# EAGLE design fpv (EAGLE 6.5.0)
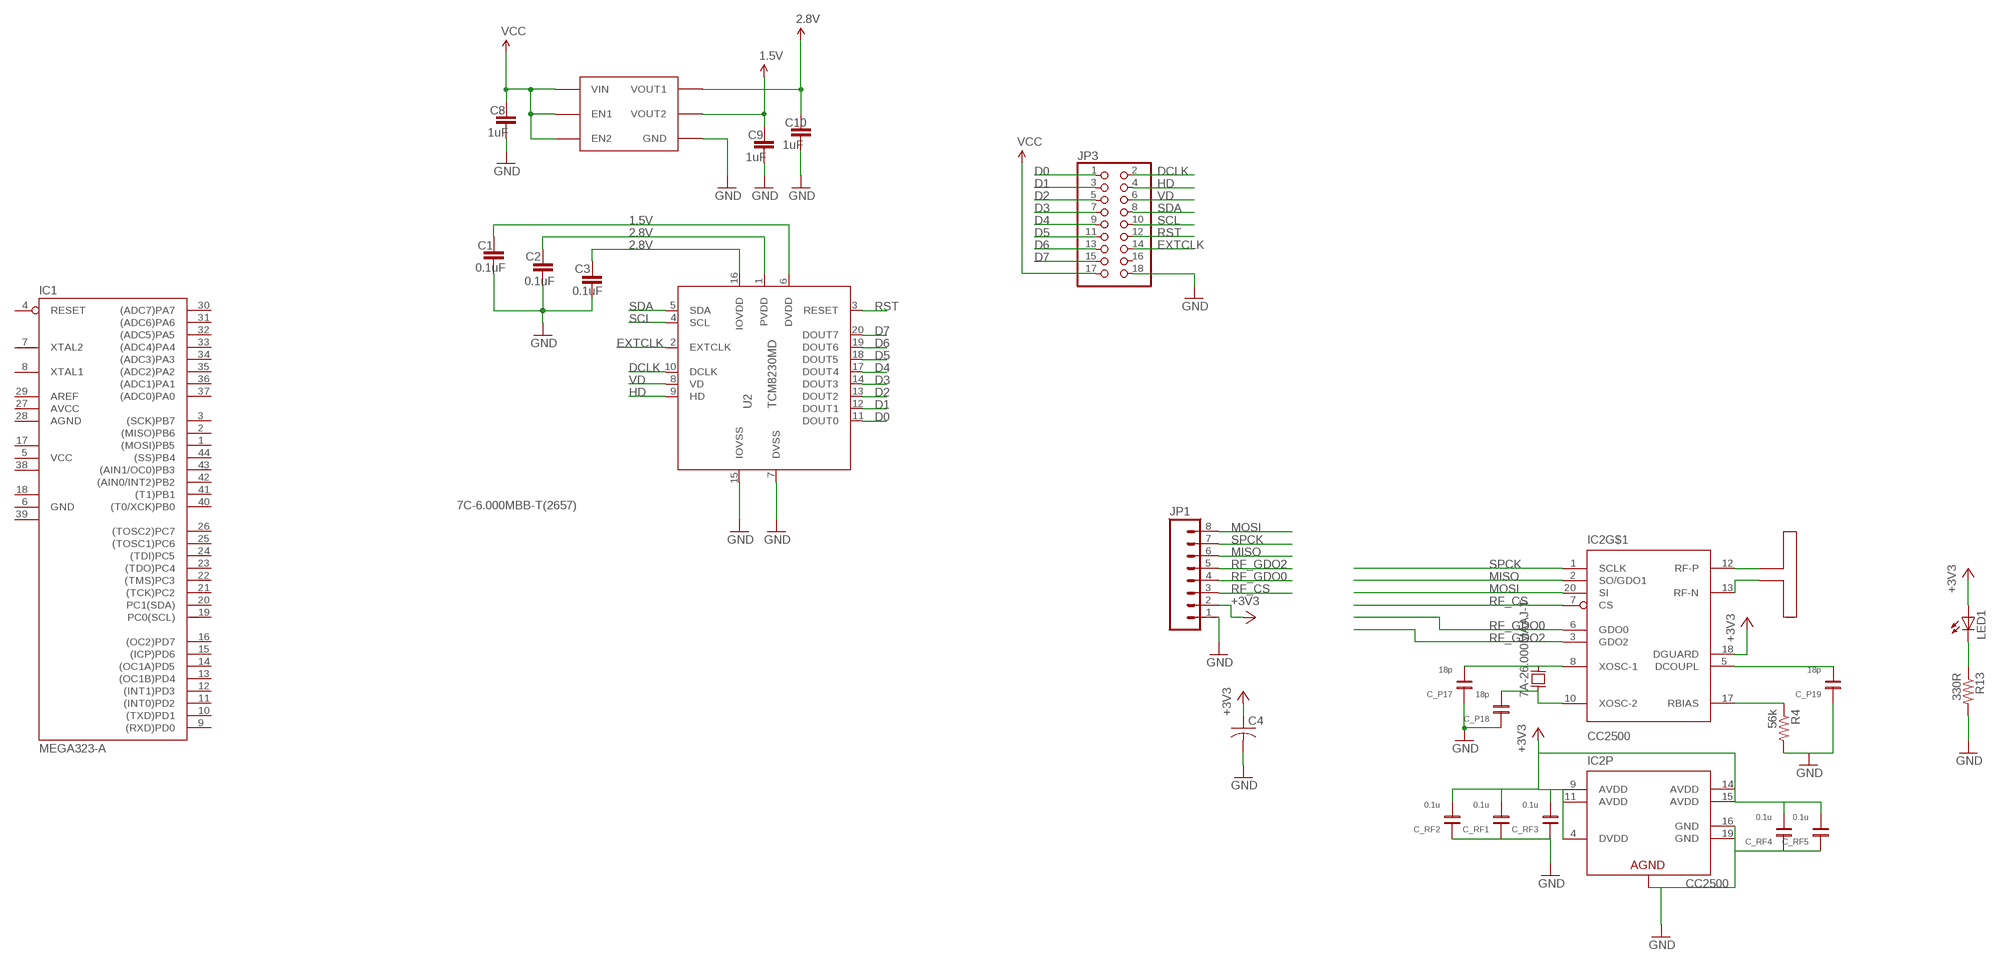
[diagram p0: schematic, sheet 1]

## Parts
C1  0.1uF  CAP0402-CAP  [0402-CAP]
C2  0.1uF  CAP0402-CAP  [0402-CAP]
C3  0.1uF  CAP0402-CAP  [0402-CAP]
C4  C-USC1206  [C1206]
C8  1uF  CAP0402-CAP  [0402-CAP]
C9  1uF  CAP0402-CAP  [0402-CAP]
C10  1uF  CAP0402-CAP  [0402-CAP]
C_P17  18p  CAPACITOR0603-CAP  [0603-CAP]
C_P18  18p  CAPACITOR0603-CAP  [0603-CAP]
C_P19  18p  CAPACITOR0603-CAP  [0603-CAP]
C_RF1  0.1u  CAPACITOR0603-CAP  [0603-CAP]
C_RF2  0.1u  CAPACITOR0603-CAP  [0603-CAP]
C_RF3  0.1u  CAPACITOR0603-CAP  [0603-CAP]
C_RF4  0.1u  CAPACITOR0603-CAP  [0603-CAP]
C_RF5  0.1u  CAPACITOR0603-CAP  [0603-CAP]
IC1  MEGA323-A  [TQFP44]
IC2  CC2500  [QLP-20]
JP1  M081X08  [1X08]
JP3  PINHD-2X9  [2X09]
LED1  LED1206  [LED-1206]
R4  56k  RESISTOR0402-RES  [0402-RES]
R13  330R  RESISTOR0402-RES  [0402-RES]
U1  MIC5320  [SOT23-6]
U2  TCM8230MD  [TCM8230MD]
U$22  ANTENNA_DIPOLE  [CC2500_FOLDED_DIPOLE_ANTENNA]
U$23  7A-26.000MAAJ-T  XTAL_2_PIN5MMX3.2MM  [5X3.2MM_SMD_XTAL]

## Nets
1.5V: C1.1 C9.1 U1.5(VOUT2) U2.6(DVDD)
2.8V: C2.1 C3.1 C10.1 U1.4(VOUT1) U2.1(PVDD) U2.16(IOVDD)
+3V3 [Power]: C4.1 C_RF1.2 C_RF2.2 C_RF3.2 C_RF4.2 C_RF5.2 IC2.4(P:DVDD) IC2.9(P:AVDD) IC2.11(P:AVDD) IC2.14(P:AVDD) IC2.15(P:AVDD) IC2.18(DGUARD) JP1.2 LED1.A
D0: JP3.1 U2.11(DOUT0)
D1: JP3.3 U2.12(DOUT1)
D2: JP3.5 U2.13(DOUT2)
D3: JP3.7 U2.14(DOUT3)
D4: JP3.9 U2.17(DOUT4)
D5: JP3.11 U2.18(DOUT5)
D6: JP3.13 U2.19(DOUT6)
D7: JP3.15 U2.20(DOUT7)
DCLK: JP3.2 U2.10(DCLK)
DCOUPL: C_P19.2 IC2.5(DCOUPL)
EXTCLK: JP3.14 U2.2(EXTCLK)
GND: C1.2 C2.2 C3.2 C4.2 C8.2 C9.2 C10.2 C_P17.1 C_P18.1 C_P19.1 C_RF1.1 C_RF2.1 C_RF3.1 C_RF4.1 C_RF5.1 IC2.16(P:GND) IC2.19(P:GND) IC2.PAD(P:AGND) IC2.THERMAL1(P:AGND) IC2.THERMAL2(P:AGND) IC2.THERMAL3(P:AGND) IC2.THERMAL4(P:AGND) IC2.THERMAL5(P:AGND) JP1.1 JP3.18 R4.2 R13.2 U1.2(GND) U2.7(DVSS) U2.15(IOVSS)
HD: JP3.4 U2.9(HD)
MISO: IC2.2(SO/GDO1) JP1.6
MOSI: IC2.20(SI) JP1.8
N$6: LED1.C R13.1
N$8: IC2.12(RF-P) U$22.P$1
N$13: IC2.13(RF-N) U$22.P$2
N$15: C_P17.2 IC2.8(XOSC-1) U$23.X2
N$20: C_P18.2 IC2.10(XOSC-2) U$23.X1
N$23: IC2.17(RBIAS) R4.1
RF_CS: IC2.7(CS) JP1.3
RF_GDO0: IC2.6(GDO0) JP1.4
RF_GDO2: IC2.3(GDO2) JP1.5
RST: JP3.12 U2.3(RESET)
SCL: JP3.10 U2.4(SCL)
SDA: JP3.8 U2.5(SDA)
SPCK: IC2.1(SCLK) JP1.7
VCC: C8.1 JP3.17 U1.1(EN2) U1.3(VIN) U1.6(EN1)
VD: JP3.6 U2.8(VD)
Unconnected: IC1.1((MOSI)PB5) IC1.2((MISO)PB6) IC1.3((SCK)PB7) IC1.4(RESET) IC1.7(XTAL2) IC1.8(XTAL1) IC1.9((RXD)PD0) IC1.10((TXD)PD1) IC1.11((INT0)PD2) IC1.12((INT1)PD3) IC1.13((OC1B)PD4) IC1.14((OC1A)PD5) IC1.15((ICP)PD6) IC1.16((OC2)PD7) IC1.19(PC0(SCL)) IC1.20(PC1(SDA)) IC1.21((TCK)PC2) IC1.22((TMS)PC3) IC1.23((TDO)PC4) IC1.24((TDI)PC5) IC1.25((TOSC1)PC6) IC1.26((TOSC2)PC7) IC1.29(AREF) IC1.30((ADC7)PA7) IC1.31((ADC6)PA6) IC1.32((ADC5)PA5) IC1.33((ADC4)PA4) IC1.34((ADC3)PA3) IC1.35((ADC2)PA2) IC1.36((ADC1)PA1) IC1.37((ADC0)PA0) IC1.40((T0/XCK)PB0) IC1.41((T1)PB1) IC1.42((AIN0/INT2)PB2) IC1.43((AIN1/OC0)PB3) IC1.44((SS)PB4) JP3.16

## Notes on the sheet
- 7C-6.000MBB-T(2657)

## Power pins joined to a net without a drawn wire
AGND: IC1.28(AGND)
AVCC: IC1.27(AVCC)
GND: IC1.6(GND)
GND1: IC1.18(GND1)
GND2: IC1.39(GND2)
VCC: IC1.5(VCC)
VCC1: IC1.17(VCC1)
VCC2: IC1.38(VCC2)

## Library data of the parts
C1-C3 C8-C10 = sfe:CAP: Capacitor Standard 0603 ceramic capacitor, and 0.1" leaded capacitor.
C4 = rcl:C-US: CAPACITOR, American symbol
C_P17-C_P19 C_RF1-C_RF5 = taylor:CAPACITOR
IC1 = atmel:MEGA323: MICROCONTROLLER 32 Kbytes FLASH 2 Kbytes SRAM 1 Kbytes EEPROM USART 8-channel 10 bit ADC Source: avr.lbr; OC_FARNELL: unknown; OC_NEWARK: unknown
IC2 = chipcon-ti:CC2500: Single Chip Low Cost Low Power RF Transceiver frequency band at 2400MHz-2483.5MHz.
JP1 = SparkFun:M08: Header 8 Standard 8-pin 0.1" header. Use with straight break away headers (SKU : PRT-00116), right angle break away headers (PRT-00553), swiss pins (PRT-00743), machine pins (PRT-00117), and female headers (PRT-00115).
JP3 = pinhead:PINHD-2X9: PIN HEADER
LED1 = SparkFun:LED: LEDs Standard schematic elements and footprints for 5mm, 3mm, 1206, and 0603 sized LEDs. 5mm - Spark Fun Electronics SKU : COM-00529 (and others)
R4 R13 = SparkFun:RESISTOR: Resistor Basic schematic elements and footprints for 0603, 1206, and PTH resistors.
U1 = heka:MIC5320
U2 = tcm82x0md:TCM8230MD: TCM8240MD 0.3 Mega pixel sensor chip mfg TOSHIBA symbol/package by Kyrre Aalerud Note: Chip has pads for socket mounting on underside. Do not route anything under the chip unless you insulate it.
U$22 = taylor:ANTENNA_DIPOLE
U$23 = taylor:XTAL_2_PIN: 5mm x 3.2mm smd crystal 16MHz and other 8pF load caps 644-1037-1-ND NX5032GA-16.000000MHZ 6mmx3.5mm 18.432MHz and 20MHz crystals 20pF load XC826CT-ND XC830CT-ND ABS06 RTC 535-10104-1-ND 18pf

## Net classes
0 default: width 0.254 mm, drill 0.508 mm, clearance 0.254 mm
1 Power: width 0.762 mm, drill 0.889 mm, clearance 0.203 mm

## Board
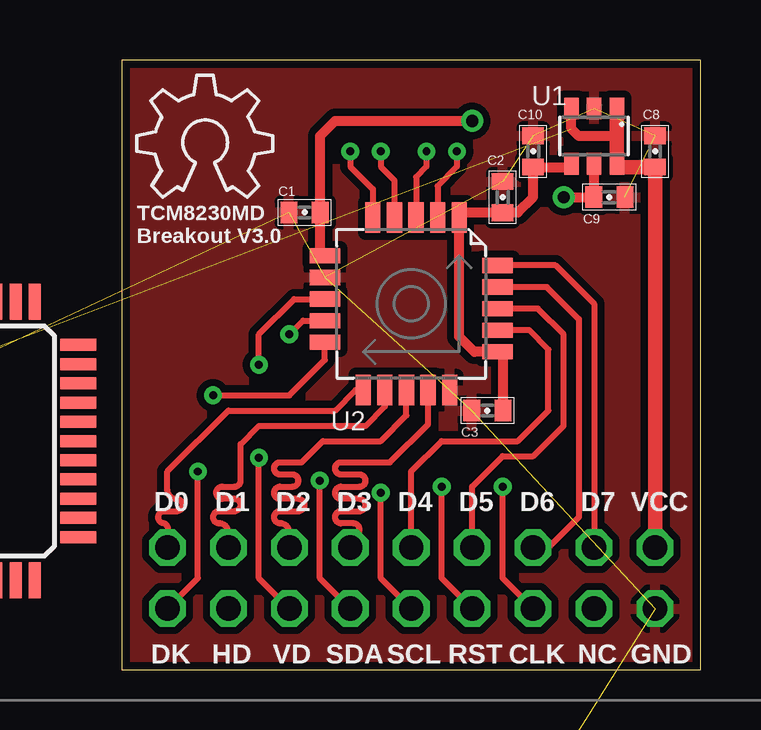
[diagram p1: board, top side]
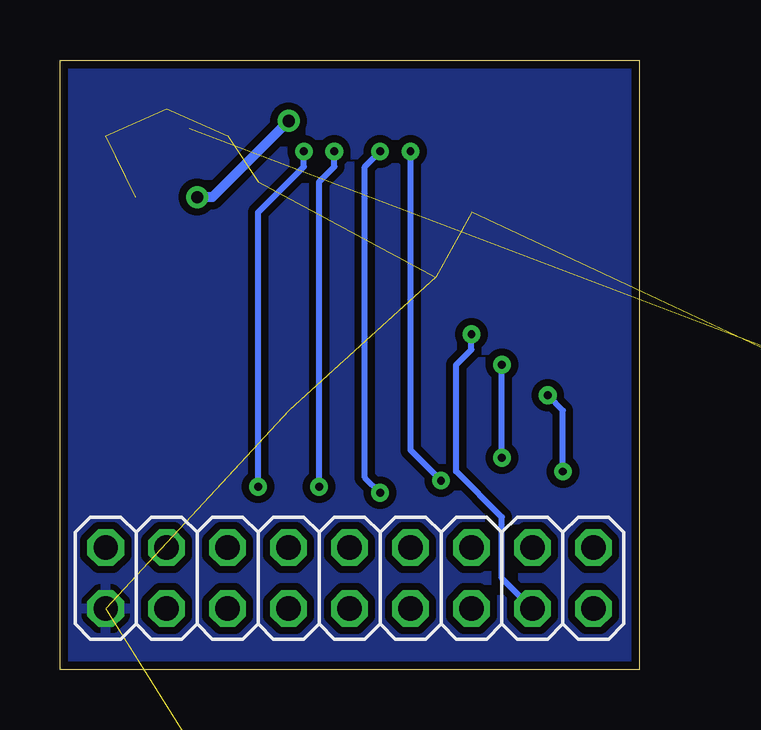
[diagram p2: board, bottom side, seen from below]

Size 24.13 x 25.4 mm. Coordinates in mm from the lower left corner, seen from the top.
Outline: 0,0 24.13,0 24.13,25.4 0,25.4 0,0
Copper layers (1*16): Top 0.035mm / dielectric 1.5mm / Bottom 0.035mm
Design rules "default *": minimum track width 8mil, minimum drill 13mil, track to track 8mil, track to pad 8mil, pad to pad 8mil, via to via 8mil, smd to smd 8mil, copper to edge 13mil, drill to drill 8mil, minimum pad ring 10mil, minimum via ring 8mil, stop-mask expansion 4mil, vias tented up to drill 20mil, thermal gap 10mil

### Footprints (pad centres in the part's own frame; a part is rotated, then mirrored left to right if it is on the bottom)
0402-CAP = smd 0.7 x 0.9: 1 -0.65,0; 2 0.65,0
C1206 = smd 1.6 x 1.8: 1 -1.4,0; 2 1.4,0
0603-CAP = smd 0.6 x 0.8: 1 -0.74,0; 2 0.74,0
TQFP44 = smd 1.5 x 0.5: 1 -5.8,4; 2 -5.8,3.2; 3 -5.8,2.4; 4 -5.8,1.6; 5 -5.8,0.8; 6 -5.8,0; 7 -5.8,-0.8; 8 -5.8,-1.6; 9 -5.8,-2.4; 10 -5.8,-3.2; 11 -5.8,-4; 23 5.8,-4; 24 5.8,-3.2; 25 5.8,-2.4; 26 5.8,-1.6; 27 5.8,-0.8; 28 5.8,0; 29 5.8,0.8; 30 5.8,1.6; 31 5.8,2.4; 32 5.8,3.2; 33 5.8,4 | smd 0.5 x 1.5: 12 -4,-5.8; 13 -3.2,-5.8; 14 -2.4,-5.8; 15 -1.6,-5.8; 16 -0.8,-5.8; 17 0,-5.8; 18 0.8,-5.8; 19 1.6,-5.8; 20 2.4,-5.8; 21 3.2,-5.8; 22 4,-5.8; 34 4,5.8; 35 3.2,5.8; 36 2.4,5.8; 37 1.6,5.8; 38 0.8,5.8; 39 0,5.8; 40 -0.8,5.8; 41 -1.6,5.8; 42 -2.4,5.8; 43 -3.2,5.8; 44 -4,5.8
QLP-20 = smd 0.76 x 0.28: 1 -1.78,1; 2 -1.78,0.5; 3 -1.78,0; 4 -1.78,-0.5; 5 -1.78,-1; 11 1.78,-1; 12 1.78,-0.5; 13 1.78,0; 14 1.78,0.5; 15 1.78,1 | smd 0.28 x 0.76: 6 -1,-1.78; 7 -0.5,-1.78; 8 0,-1.78; 9 0.5,-1.78; 10 1,-1.78; 16 1,1.78; 17 0.5,1.78; 18 0,1.78; 19 -0.5,1.78; 20 -1,1.78 | smd 2.4 x 2.4: PAD 0,0 | drill 0.254: THERMAL1 0,0; THERMAL2 -0.635,0.635; THERMAL3 0.635,0.635; THERMAL4 0.635,-0.635; THERMAL5 -0.635,-0.635
1X08 = drill 1.016 pad 1.88 square: 1 0,0 | drill 1.016 pad 1.88: 2 2.54,0; 3 5.08,0; 4 7.62,0; 5 10.16,0; 6 12.7,0; 7 15.24,0; 8 17.78,0
2X09 = drill 1.016 octagon: 1 -10.16,-1.27; 2 -10.16,1.27; 3 -7.62,-1.27; 4 -7.62,1.27; 5 -5.08,-1.27; 6 -5.08,1.27; 7 -2.54,-1.27; 8 -2.54,1.27; 9 0,-1.27; 10 0,1.27; 11 2.54,-1.27; 12 2.54,1.27; 13 5.08,-1.27; 14 5.08,1.27; 15 7.62,-1.27; 16 7.62,1.27; 17 10.16,-1.27; 18 10.16,1.27
LED-1206 = smd 1.2 x 1.4: A -1.5,0; C 1.5,0
0402-RES = smd 0.6 x 0.8: 1 -0.74,0; 2 0.74,0
SOT23-6 = smd 0.6 x 0.9: 1 -0.95,-1.15; 2 0,-1.15; 3 0.95,-1.15; 4 0.95,1.15; 5 0,1.15; 6 -0.95,1.15
TCM8230MD = smd 0.635 x 1.27: 1 2,3.6; 2 1.1,3.6; 3 0.2,3.6; 4 -0.7,3.6; 5 -1.6,3.6; 11 -2,-3.6; 12 -1.1,-3.6; 13 -0.2,-3.6; 14 0.7,-3.6; 15 1.6,-3.6 | smd 1.27 x 0.635: 6 -3.6,2; 7 -3.6,1.1; 8 -3.6,0.2; 9 -3.6,-0.7; 10 -3.6,-1.6; 16 3.6,-2; 17 3.6,-1.1; 18 3.6,-0.2; 19 3.6,0.7; 20 3.6,1.6
CC2500_FOLDED_DIPOLE_ANTENNA = smd 0.28 x 0.28: P$1 0.25,-16.4; P$2 -0.25,-16.4
5X3.2MM_SMD_XTAL = smd 1.3 x 2: X1 -1.85,0; X2 1.85,0

### Placement (x,y rotation side)
C1  7.62,19.05 180 top
C2  15.88,19.69 90 top
C3  15.24,10.8 180 top
C4  10.16,-32.38 0 top  (outside the outline)
C8  22.23,21.59 90 top
C9  20.32,19.69 0 top
C10  17.14,21.59 90 top
C_P17  19.68,-30.48 0 top  (outside the outline)
C_P18  -12.7,-36.19 0 top  (outside the outline)
C_P19  -9.53,-36.19 0 top  (outside the outline)
C_RF1  -6.35,-36.19 0 top  (outside the outline)
C_RF2  -3.17,-36.19 0 top  (outside the outline)
C_RF3  0,-36.19 0 top  (outside the outline)
C_RF4  3.17,-36.19 0 top  (outside the outline)
C_RF5  6.35,-36.19 0 top  (outside the outline)
IC1  -7.62,9.53 0 top
IC2  -10.79,-23.49 0 top  (outside the outline)
JP1  -12.06,-33.02 0 top  (outside the outline)
JP3  12.06,3.81 180 bottom
LED1  15.24,-31.11 0 top  (outside the outline)
R4  3.17,-21.59 0 top  (outside the outline)
R13  6.35,-21.59 0 top  (outside the outline)
U1  19.68,22.23 180 top
U2  12.06,15.24 0 top
U$5  [OSHW_6X200_NOTEXT]  0.64,19.69 0 top
U$22  10.16,-1.27 0 top  (outside the outline)
U$23  -1.27,-22.22 0 top  (outside the outline)

### Tracks (layer width: path | path; a pad name or v marks a point on that pad's centre or on a via)
1.5V  (via drill 0.51)
  Top 0.254: U2.6 8.27,17.44
  Top 0.406: v18.41,19.69 C9.1 19.68,19.7 U1.5 | 8.27,17.44 C1.1 8.27,22.24 8.89,22.86 v14.61,22.86
  Bottom 0.406: v18.41,19.69 17.78,19.69 v14.61,22.86
2.8V
  Top 0.254: C2.1 | U2.1 14.28,19.05 | 15.89,13.02 U2.16
  Top 0.406: U2.16 14.7,13.24 14.06,13.88 U2.1 | U1.4 18.6,20.94 C10.1 17.14,19.69 16.51,19.05 C2.1 14.28,19.05 | C3.1 15.89,13.02
+3V3  (13 unrouted)
D0
  Top 0.254: JP3.1 1.91,5.72 arc90 1.78,6.1 arc-90 1.52,6.35 arc-90 1.78,6.6 2.29,6.6 arc90 2.54,6.86 arc90 2.29,7.11 arc-90 1.91,7.49 1.91,8.26 4.45,10.8 8.89,10.8 9.73,11.64 U2.11
D1
  Top 0.254: U2.12 10.96,10.97 10.16,10.16 5.71,10.16 4.95,9.4 4.95,7.87 arc-90 4.7,7.62 4.19,7.62 arc90 3.94,7.37 arc90 4.19,7.11 4.7,7.11 arc-90 4.95,6.86 arc-90 4.7,6.6 4.06,6.6 arc90 3.81,6.35 arc90 4.06,6.1 arc-90 4.45,5.72 JP3.3
D2
  Top 0.254: U2.13 11.87,10.6 10.79,9.53 8.38,9.53 7.49,8.64 6.6,8.64 arc90 6.35,8.38 arc90 6.6,8.13 7.11,8.13 arc-90 7.37,7.87 arc-90 7.11,7.62 6.6,7.62 arc90 6.35,7.37 arc90 6.6,7.11 7.37,7.11 arc-90 7.62,6.86 arc-90 7.37,6.6 6.6,6.6 arc90 6.35,6.35 arc90 6.6,6.1 arc-90 6.99,5.72 JP3.5
D3
  Top 0.254: U2.14 12.77,10.23 11.18,8.64 9.14,8.64 arc90 8.89,8.38 arc90 9.14,8.13 9.91,8.13 arc-90 10.16,7.87 arc-90 9.91,7.62 9.14,7.62 arc90 8.89,7.37 arc90 9.14,7.11 9.91,7.11 arc-90 10.16,6.86 arc-90 9.91,6.6 9.14,6.6 arc90 8.89,6.35 arc90 9.14,6.1 9.65,6.1 arc-90 9.91,5.84 arc-90 9.65,5.59 9.53,5.59 arc90 JP3.7
D4
  Top 0.254: U2.17 16.98,14.14 17.78,13.34 17.78,10.8 16.51,9.53 13.34,9.53 12.06,8.26 JP3.9
D5
  Top 0.254: U2.18 17.34,15.04 18.41,13.97 18.41,10.16 17.14,8.89 15.88,8.89 14.61,7.62 JP3.11
D6
  Top 0.254: U2.19 17.71,15.94 19.05,14.61 19.05,6.35 17.78,5.08 JP3.13
D7
  Top 0.254: U2.20 18.09,16.84 19.68,15.24 JP3.15
DCLK  (via drill 0.33)
  Top 0.254: v3.17,8.26 3.17,3.81 JP3.2 | U2.10 8.46,12.91 6.99,11.43 v3.81,11.43
  Bottom 0.254: v3.81,11.43 3.17,10.8 v3.17,8.26
DCOUPL  (1 unrouted)
EXTCLK  (via drill 0.33)
  Top 0.254: U2.2 13.16,20.15 13.97,20.96 v13.97,21.59 | v15.88,7.62 15.88,3.81 JP3.14
  Bottom 0.254: v13.97,21.59 13.97,20.96 15.88,19.05 v15.88,7.62
GND  (29 unrouted)
  pour Bottom (isolate 0.305): 0,0 0,25.4 24.13,25.4 24.13,0
  pour Top (isolate 0.305): 0,0 0,25.4 24.13,25.4 24.13,0
HD  (via drill 0.33)
  Top 0.254: U2.9 7.55,14.54 v6.99,13.97
  Bottom 0.254: JP3.4 5.71,3.81 5.71,6.35 7.62,8.26 7.62,12.7 6.99,13.34 v6.99,13.97
MISO  (1 unrouted)
MOSI  (1 unrouted)
N$6  (1 unrouted)
N$8  (1 unrouted)
N$13  (1 unrouted)
N$15  (2 unrouted)
N$20  (2 unrouted)
N$23  (1 unrouted)
RF_CS  (1 unrouted)
RF_GDO0  (1 unrouted)
RF_GDO2  (1 unrouted)
RST  (via drill 0.33)
  Top 0.254: U2.3 12.27,20.52 12.7,20.96 v12.7,21.59 | v13.34,7.62 13.34,3.81 JP3.12
  Bottom 0.254: v12.7,21.59 12.7,20.96 13.34,20.32 v13.34,7.62
SCL  (via drill 0.33)
  Top 0.254: U2.4 11.37,20.39 10.79,20.96 v10.79,21.59 | v10.79,7.37 10.79,3.81 JP3.10
  Bottom 0.254: v10.79,21.59 11.43,20.96 11.43,8 v10.79,7.37
SDA  (via drill 0.33)
  Top 0.254: U2.5 10.46,20.02 9.53,20.96 v9.53,21.59 | v8.26,7.87 8.26,3.81 JP3.8
  Bottom 0.254: v9.53,21.59 9.53,9.14 v8.26,7.87
SPCK  (1 unrouted)
VCC  (1 unrouted)
  Top 0.406: U1.3 18.73,22.54 19.05,22.23 20.64,22.23
  Top 0.61: JP3.17 C8.1 20.77,20.94 U1.6 20.64,22.23 U1.1
VD  (via drill 0.33)
  Top 0.254: U2.8 7.18,15.44 5.71,13.97 v5.71,12.7 | v5.71,8.83 5.71,3.81 JP3.6
  Bottom 0.254: v5.71,8.83 v5.71,12.7

### Text on the board
tPlace: TCM8230MD | Breakout V3.0 | D0 | D1 | D2 | D3 | D4 | D5 | D6 | D7 | VCC | DK | HD | VD | SDA | SCL | RST | CLK | NC | GND